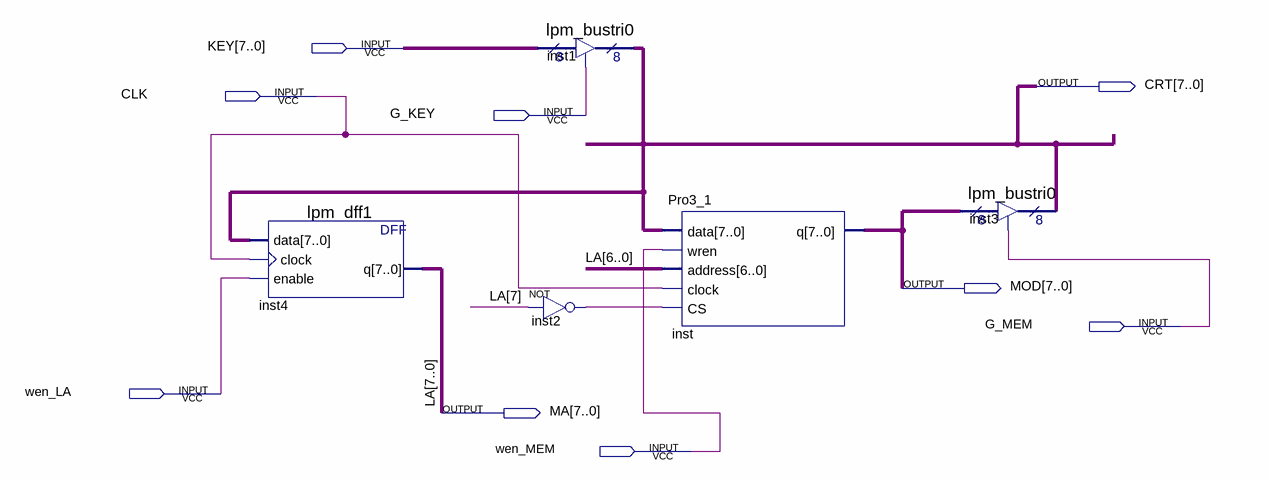
[diagram p0: schematic sheet]
// Quartus schematic Pro3_2.bdf as structural Verilog: 5 symbols, 9 pins
module Pro3_2 (
  input  [7:0] KEY,
  input  CLK,
  input  G_KEY,
  input  G_MEM,
  input  wen_LA,
  input  wen_MEM,
  output [7:0] CRT,
  output [7:0] MOD,
  output [7:0] MA
);

  wire inst2_out;

  lpm_dff1 inst4 (.data(CRT), .clock(CLK), .enable(wen_LA), .q(MA));
  lpm_bustri0 inst1 (.enabledt(G_KEY), .data(KEY), .tridata(CRT));
  not inst2 (inst2_out, MA[7]);
  Pro3_1 inst (.data(CRT), .wren(wen_MEM), .address(MA[6:0]), .clock(CLK), .CS(inst2_out), .q(MOD));
  lpm_bustri0 inst3 (.enabledt(G_MEM), .data(MOD), .tridata(CRT));

  // Other names for the same wires on the sheet: LA[7:0] = MA
endmodule
